# EAGLE design design-1v3 (EAGLE 9.5.1)
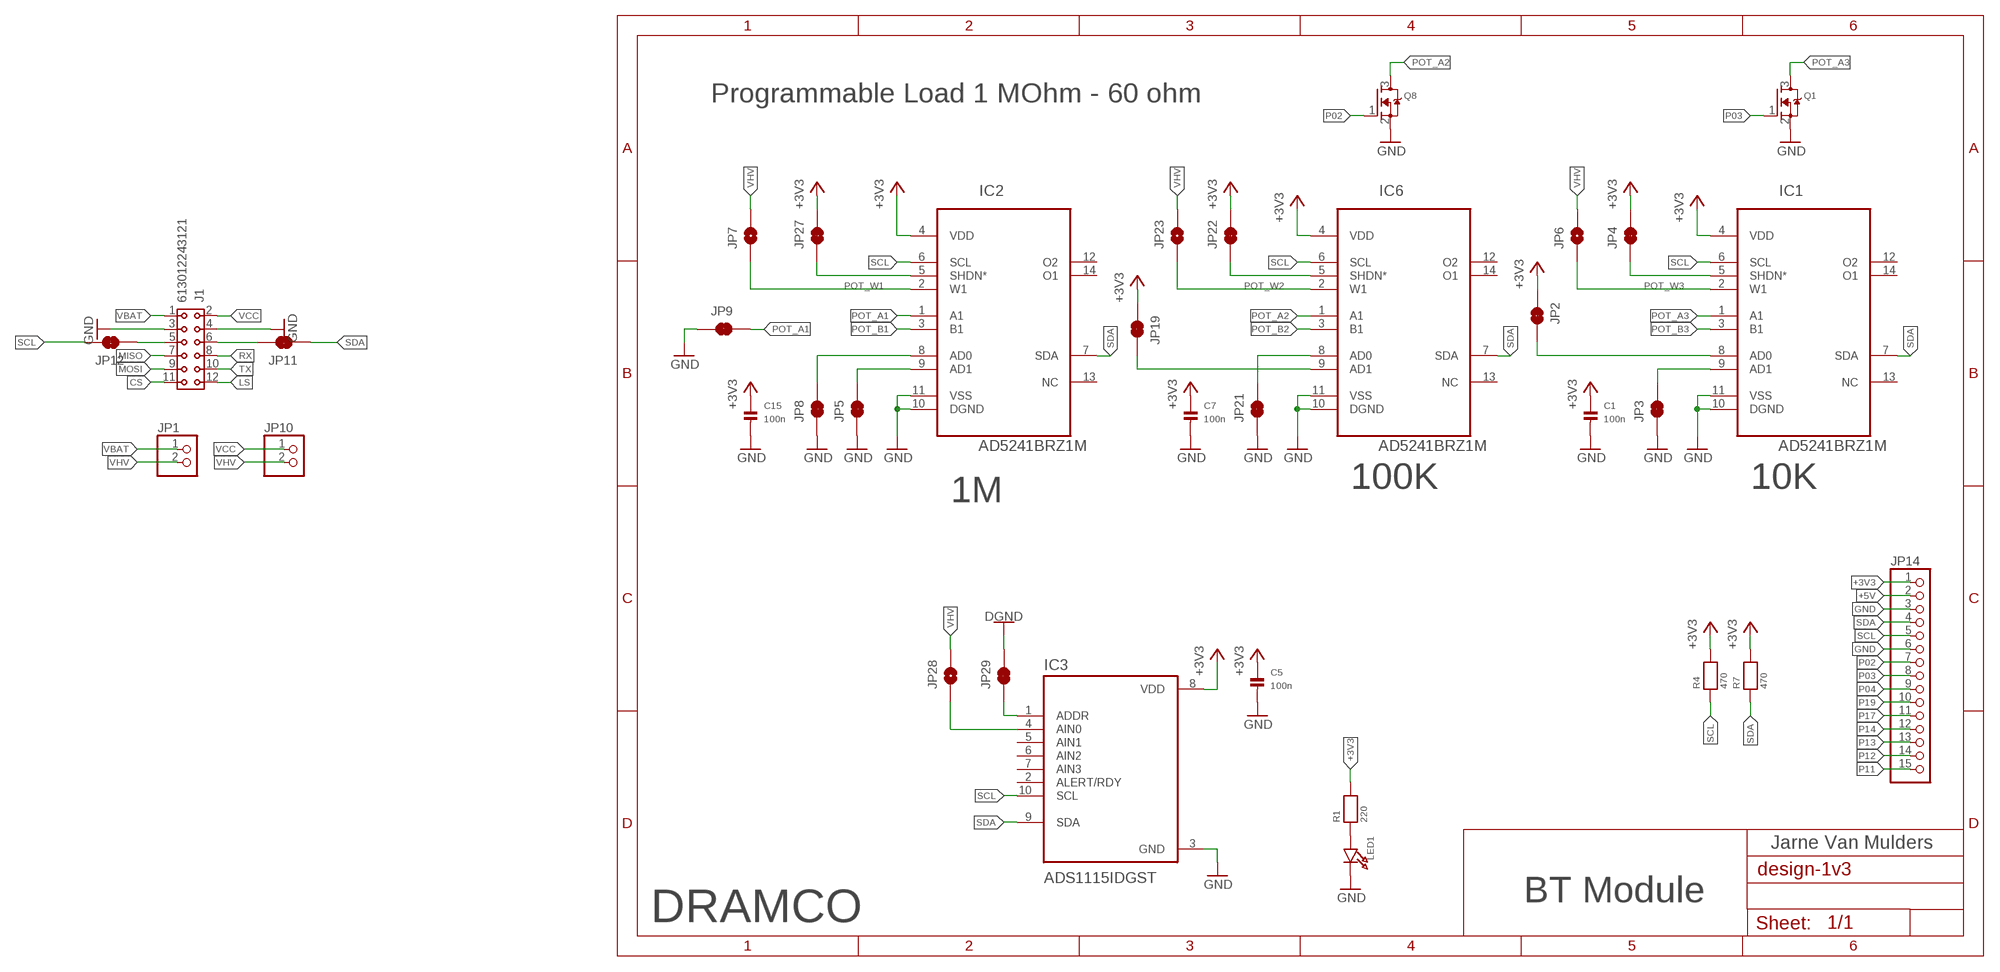
[diagram p0: schematic, sheet 1]

## Parts
C1  100n  CAP_CERAMIC0603  [0603]
C5  100n  CAP_CERAMIC0603  [0603]
C7  100n  CAP_CERAMIC0603  [0603]
C15  100n  CAP_CERAMIC0603  [0603]
IC1  AD5241BRZ1M  [SOIC127P600X175-14N]
IC2  AD5241BRZ1M  [SOIC127P600X175-14N]
IC3  ADS1115IDGST  [SOP50P490X110-10N]
IC6  AD5241BRZ1M  [SOIC127P600X175-14N]
J1  613012243121  6130XX243121_613012243121  [613012243121]
JP1  HEADER-1X2ROUND  [1X02_ROUND]
JP2  JUMPER-SMT_2_NC_TRACE_NO-SILK  [SMT-JUMPER_2_NC_TRACE_NO-SILK]
JP3  JUMPER-SMT_2_NC_TRACE_NO-SILK  [SMT-JUMPER_2_NC_TRACE_NO-SILK]
JP4  JUMPER-SMT_2_NC_TRACE_NO-SILK  [SMT-JUMPER_2_NC_TRACE_NO-SILK]
JP5  JUMPER-SMT_2_NC_TRACE_NO-SILK  [SMT-JUMPER_2_NC_TRACE_NO-SILK]
JP6  JUMPER-SMT_2_NO_NO-SILK  [SMT-JUMPER_2_NO_NO-SILK]
JP7  JUMPER-SMT_2_NO_NO-SILK  [SMT-JUMPER_2_NO_NO-SILK]
JP8  JUMPER-SMT_2_NC_TRACE_NO-SILK  [SMT-JUMPER_2_NC_TRACE_NO-SILK]
JP9  JUMPER-SMT_2_NC_TRACE_NO-SILK  [SMT-JUMPER_2_NC_TRACE_NO-SILK]
JP10  HEADER-1X2ROUND  [1X02_ROUND]
JP11  JUMPER-SMT_2_NC_TRACE_NO-SILK  [SMT-JUMPER_2_NC_TRACE_NO-SILK]
JP12  JUMPER-SMT_2_NC_TRACE_NO-SILK  [SMT-JUMPER_2_NC_TRACE_NO-SILK]
JP14  HEADER-1X15  [1X15_ROUND_70]
JP19  JUMPER-SMT_2_NC_TRACE_NO-SILK  [SMT-JUMPER_2_NC_TRACE_NO-SILK]
JP21  JUMPER-SMT_2_NC_TRACE_NO-SILK  [SMT-JUMPER_2_NC_TRACE_NO-SILK]
JP22  JUMPER-SMT_2_NC_TRACE_NO-SILK  [SMT-JUMPER_2_NC_TRACE_NO-SILK]
JP23  JUMPER-SMT_2_NO_NO-SILK  [SMT-JUMPER_2_NO_NO-SILK]
JP27  JUMPER-SMT_2_NC_TRACE_NO-SILK  [SMT-JUMPER_2_NC_TRACE_NO-SILK]
JP28  JUMPER-SMT_2_NO_NO-SILK  [SMT-JUMPER_2_NO_NO-SILK]
JP29  JUMPER-SMT_2_NC_TRACE_NO-SILK  [SMT-JUMPER_2_NC_TRACE_NO-SILK]
LED1  LED0805  [CHIPLED_0805]
Q1  MOSFET-NREFLOW  [SOT23-R]
Q8  MOSFET-NREFLOW  [SOT23-R]
R1  220  RESISTOR0603  [0603]
R4  470  RESISTOR0603  [0603]
R7  470  RESISTOR0603  [0603]

## Nets
+3V3: C1.1 C5.1 C7.1 C15.1 IC1.4(VDD) IC2.4(VDD) IC3.8(VDD) IC6.4(VDD) JP2.1 JP4.2 JP14.1 JP19.1 JP22.2 JP27.2 R1.2 R4.2 R7.2
+5V: JP14.2
CS: J1.11
GND: C1.2 C5.2 C7.2 C15.2 IC1.10(DGND) IC1.11(VSS) IC2.10(DGND) IC2.11(VSS) IC3.3(GND) IC6.10(DGND) IC6.11(VSS) J1.3 J1.4 JP3.1 JP5.1 JP8.1 JP9.1 JP14.3 JP14.6 JP21.1 JP29.2 LED1.C Q1.2(S) Q8.2(S) ; supply symbol labelled DGND
LS: J1.12
MISO: J1.7
MOSI: J1.9
N$2: IC1.8(AD0) JP2.2
N$3: IC1.9(AD1) JP3.2
N$4: IC1.5(SHDN*) JP4.1
N$5: J1.5 JP12.1
N$6: J1.6 JP11.2
N$7: IC6.9(AD1) JP19.2
N$11: IC6.8(AD0) JP21.2
N$13: IC2.5(SHDN*) JP27.1
N$15: IC2.8(AD0) JP8.2
N$16: IC2.9(AD1) JP5.2
N$20: LED1.A R1.1
N$21: IC3.4(AIN0) JP28.1
N$22: IC3.1(ADDR) JP29.1
N$23: IC6.5(SHDN*) JP22.1
P02: JP14.7 Q8.1(G)
P03: JP14.8 Q1.1(G)
P04: JP14.9
P11: JP14.15
P12: JP14.14
P13: JP14.13
P14: JP14.12
P17: JP14.11
P19: JP14.10
POT_A1: IC2.1(A1) JP9.2
POT_A2: IC6.1(A1) Q8.3(D)
POT_A3: IC1.1(A1) Q1.3(D)
POT_B1: IC2.3(B1)
POT_B2: IC6.3(B1)
POT_B3: IC1.3(B1)
POT_W1: IC2.2(W1) JP7.1
POT_W2: IC6.2(W1) JP23.1
POT_W3: IC1.2(W1) JP6.1
RX: J1.8
SCL: IC1.6(SCL) IC2.6(SCL) IC3.10(SCL) IC6.6(SCL) JP12.2 JP14.5 R4.1
SDA: IC1.7(SDA) IC2.7(SDA) IC3.9(SDA) IC6.7(SDA) JP11.1 JP14.4 R7.1
TX: J1.10
VBAT: J1.1 JP1.1
VCC: J1.2 JP10.1
VHV: JP1.2 JP6.2 JP7.2 JP10.2 JP23.2 JP28.2
Unconnected: IC1.12(O2) IC1.13(NC) IC1.14(O1) IC2.12(O2) IC2.13(NC) IC2.14(O1) IC3.2(ALERT/RDY) IC3.5(AIN1) IC3.6(AIN2) IC3.7(AIN3) IC6.12(O2) IC6.13(NC) IC6.14(O1)

## Notes on the sheet
- Programmable Load 1 MOhm - 60 ohm
- 100K | 10K
- 1M
- Jarne Van Mulders
- BT Module
- DRAMCO

## Library data of the parts
C1 C5 C7 C15 = microbuilder:CAP_CERAMIC: Ceramic Capacitors 0402 - 0402 Surface Mount Capacitors 16pF 50V 5% [Digikey: 445-4899-2-ND] 18pF 50V 5% [Digikey: 490-1281-2-ND] 22pF 50V 5% [Digikey: 490-1283-2-ND] 68pF 50V 5% [Digikey: 490-1289-2-ND] 0.1uF 10V 10% [Digikey: 490-1318-2-ND] 1.0uF 6.3V 10% [Digikey: 490-1320-2-ND] 0603 - 0603 Surface Mount Capacitors 16 pF 50V 5% [Digikey: 445-5051-2-ND] 22 pF 50V [Digikey: PCC220ACVTR-ND] 33 pF 50V 5% [Digikey: 490-1415-1-ND] 56pF 50V 5% [Digikey: 490-1421-1-ND] 220pF 50V 5% [Digikey: 445-1285-1-ND] 680 pF 50V 2200 pF 50V 5% C0G [Digikey: 445-1297-1-ND] 5600 pF 100V 5% X7R [Digikey: 478-3711-1-ND] 0.1 µF 25V 10% [Digikey: PCC2277TR-ND] 0.22 µF 16V 10% X7R [Digikey: 445-1318-1-ND] 1.0 µF 25V 10% [Digikey: 445-5146-2-ND] 0603 - RF Specific 3pF 250V +/-0.1pF RF [Digikey: 712-1347-1-ND] 18 pF 250V 5% [Digikey: 478-3505-1-ND or 712-1322-1-ND] 56 pF 250V 5% C0G RF [Digikey: 490-4867-1-ND] 68 pF 250V RF [Digikey: 490-4868-1-ND] 0805 - 0805 Surface Mount Capacitors 220 pF 250V 2% RF Ceramic Capacitor [Digikey: 712-1398-1-ND] 1000 pF 50V 2% NP0 Ceramic Capacitor [Digikey: 478-3760-1-ND] 0.1 µF 25V 10% Ceramic Capacitor [Digikey: PCC1828TR-ND] 1.0 µF 16V 10% Ceramic Capacitor[Digikey: 490-1691-2-ND] 10.0 µF 10V 10% Ceramic Capacitor[Digikey: 709-1228-1-ND] 10.0 uF 16V 10% Ceramic Capacitor [Digikey: 478-5165-2-ND] 47 uF 6.3V 20% Ceramic Capacitor [Digikey: 587-1779-1-ND or 399-5506-1-ND] 1206 - 1206 Surface Mount Capacitors 47uF 10V 20% Ceramic Capacitor [Digikey: 490-5528-1-ND or 399-5508-1-ND or 445-6010-1-ND] 100uF 6.3V -20%, +80% Y5V Ceramic Capacitor (Digikey: 490-4512-1-ND, Mouser: 81-GRM31CF50J107ZE1L)
IC1 IC2 IC6 = AD5241BRZ1M:AD5241BRZ1M: I2C Compatible Digital Potentiometer Check availability <https://pricing.snapeda.com/parts/AD5241BRZ1M/Analog%20Devices/view-part?ref=eda>; AVAILABILITY: In Stock; CHECK_PRICES: https://www.snapeda.com/parts/AD5241BRZ1M/Analog+Devices/view-part/?ref=eda; DESCRIPTION: I2C Compatible Digital Potentiometer; MF: Analog Devices; MP: AD5241BRZ1M; PACKAGE: SOIC-14 Analog Devices; PRICE: None; SNAPEDA_LINK: https://www.snapeda.com/parts/AD5241BRZ1M/Analog+Devices/view-part/?ref=snap
IC3 = ADS1115IDGST:ADS1115IDGST: Check prices <https://pricing.snapeda.com/parts/ADS1115IDGST/Texas%20Instruments/view-part?ref=eda>; AVAILABILITY: Good; DESCRIPTION: 16-Bit 860SPS 4-Ch Delta-Sigma ADC With PGA, Oscillator, Vref, Comparator, and I2C 10-VSSOP -40 to 125; MF: Texas Instruments; MP: ADS1115IDGST; PACKAGE: VSSOP-10 Texas Instruments; PRICE: None; PURCHASE-URL: https://pricing.snapeda.com/search/part/ADS1115IDGST/?ref=eda
J1 = Eagle_WR-PHD (rev25a):6130XX243121_613012243121: WR-PHD 2.54 mm Angled Dual Socket Header Article Properties Pins 4; 6; 8; 10; 12; 14; 16; 20; 22; 24; 26; 32; 34; 40; 64; 72 Material Properties Insulator Material PBT Insulator Flammability Rating UL94 V-0 Contact Material Copper Alloy Contact Plating Gold Contact Type Stamped General Information Operating Temperature -40 °C up to +105 °C Compliance Lead free / RoHS Pitch 2.54 mm Durability 25 Mating cycles Rows Dual Gender Socket Header Type Angled Electrical Properties Withstanding Voltage 500 V (AC) Contact Resistance 20 mΩ RISO 1000 MΩ CERTIFICATION UL Approval E323964 Packaging Properties Packaging Tray <https://www.we-online.com/components/media/o33216v209%20Family_WR-PHD_6130xx243121.jpg> Details see: www.we-online.com/en/components/products/PHD_2_54_ANGLED_DUAL_SOCKET_HEADER_6130XX243121 <www.we-online.com/catalog/PHD_2_54_ANGLED_DUAL_SOCKET_HEADER_6130XX243121/?utm_source=eagle_model&utm_medium=description_link&utm_campaign=eisos_eagle> Updated by Ella 2024-03-13 2024 (C) Würth Elektronik; DATASHEET-URL: https://www.we-online.com/redexpert/spec/613012243121?ae; GENDER: Socket Header; IR: 3A; MOUNT: THT; PACKAGING: Tray; PART-NUMBER: 613012243121; PINS: 12; PITCH: 2.54 mm; ROWS: Dual; TYPE: Angled
JP1 JP10 = microbuilder:HEADER-1X2: PIN HEADER
JP2-JP5 JP8 JP9 JP11 JP12 JP19 JP21 JP22 JP27 JP29 = SparkFun-Jumpers:JUMPER-SMT_2_NC_TRACE: Normally closed trace jumper This jumper has a trace between two pads so it's normally closed (NC). Use a razor knife to open the connection. For best results follow the IPC guidelines for cutting traces: Cutout at least 0.063 mm (0.005 in). Remove all loose material to clean up the cut area. Seal the cut with an approved epoxy. Reapply solder to reclose the connection.
JP6 JP7 JP23 JP28 = SparkFun-Jumpers:JUMPER-SMT_2_NO: Normally open jumper This jumper has two pads in close proximity to each other. Apply solder to close the connection. Round pads are easier to solder for beginners, but are a lot larger. SparkFun Product that uses the round pads: SparkFun EL Sequencer <https://www.sparkfun.com/products/12781>
JP14 = microbuilder:HEADER-1X15: 1x15 Header
LED1 = microbuilder:LED: LED 0603 - 0603 Surface Mount Package 2mA: Green LED - Low Power (3.9mcd, 2ma, 1.7Vf) - Digikey: 475-2709-2-ND Orange LED - Low Power (9.8mcd, 2ma, 1.8Vf) - Digikey: 475-1194-2-ND Red LED - Low Power (5mcd, 2ma, 1.8Vf) - Digikey: 475-1195-2-ND Yellow LED - Low Power (7mcd, 2ma, 1.8Vf) - Digikey: 475-1196-2-ND 5mA: Blue LED - Low Power (17mcd, 5ma, 2.9Vf) - Digikey: LNJ937W8CRACT-ND 0805 - 0805 Surface Mount Package 2mA: Red LED (8.8mcd, 2mA, 1.8Vf, Clear) - Low Power [Digikey: 475-2510-1-ND] Green LED (5mcd, 2mA, 1.8Vf, Clear) - Low Power [Digikey: 475-2730-1-ND] Yellow LED (11.3mcd, 2mA, 1.8Vf, Clear) - Low Power [Digikey: 475-2555-1-ND] 20mA: Red LED (104mcd, 20mA, Diffused) - LS R976 [Digikey: 475-1278-6-ND] Red LED (12mcd, 20mA, 2.0Vf, Clear) - APT2012EC [Digikey: 754-1128-1-ND] Green LED (15mcd, 20mA, 2.2Vf, Clear) - APT2012GC [Digikey: 754-1131-1-ND] Orange LED (160mcd, 20mA, 2.1Vf, Clear) - APT2012SECK [Digikey: 754-1130-1-ND] 1206 - 1206 Surface Mount Package Green LED (26mcd, 20mA, Diffused) - LG N971 [Digikey: 475-1407-6-ND] Red LED (15mcd, 20mA, Diffused) - LH N974 [Digikey: 475-1416-6-ND]
Q1 Q8 = microbuilder:MOSFET-N: N-Channel Mosfet LEGEND VDS: Voltage Drain-Source ID: Drain Current RDS(ON): Drain-Source On-State Resistance VGS(TH): Gate-Source Threshold Voltage CISS: Drain-Source Input Capacitance SOT-23 Name VDS ID RDS(ON) VGS(TH) CISS Order Number 2N7002E 60V 260mA 2.5 Ohm 2.5V @ 250uA 26.7pF @ 25V 2N7002ET1GOSTR-ND BSH103 30V 850mA 400 mOhm 400mV @ 1mA 83pF @ 24V BSH103,235-ND BSS138 60V 320mA 1.6 Ohm 1.5V @ 250uA 50pF @ 10V Mouser: 771-BSS138PW115 DMN2075U-7 20V 4.2A 38 mOhm 1V @ 250 uA 594.3pF @ 10V DMN2075U-7DICT-ND * BSS138 good choice for I2C level-shifting
R1 R4 R7 = microbuilder:RESISTOR: Resistors 0402 - 0402 Surface Mount Package 22 Ohm 1% 1/16W [Digikey: 311-22.0LRTR-ND] 33 Ohm 5% 1/16W 1.0K 5% 1/16W 1.5K 5% 1/16W 2.0K 1% 1/16W 10.0K 1% 1/16W [Digikey: 311-10.0KLRTR-ND] 10.0K 5% 1/16W [Digikey: RMCF0402JT10K0TR-ND] 12.1K 1% 1/16W [Digikey: 311-22.0LRTR-ND] 100.0K 5% 1/16W 0603 - 0603 Surface Mount Package 0 Ohm 1/10 Watt 1% Resistor 15 Ohm 1/10 Watt 1% Resistor 33 Ohm 1/10 Watt 1% Resistor 49.9 Ohm 1/10 Watt 1% Resistor 100 Ohm 1/10 Watt 1% Resistor 150 Ohm 1/10 Watt 1% Resistor 240 Ohm 1/10 Watt 1% Resistor 390 Ohm 1/10 Watt 1% Resistor 560 Ohm 1/10 Watt 1% Resistor 680 Ohm 1/10 Watt 1% Resistor 750 Ohm 1/10 Watt 1% Resistor 1.0K Ohm 1/10 Watt 1% Resistor 1.5K Ohm 1/10 Watt 1% Resistor 2.0K Ohm 1/10 Watt 1% Resistor 2.2K Ohm 1/10 Watt 1% Resistor 3.3K Ohm 1/10 Watt 1% Resistor 4.7K Ohm 1/10 Watt 1% Resistor 10.0K Ohm 1/10 Watt 1% Resistor 12.0K Ohm 1/10 Watt 1% Resistor 12.1K Ohm 1/10 Watt 1% Resistor 20.0K Ohm 1/10 Watt 1% Resistor 33.0K Ohm 1/10 Watt 1% Resistor 100.0K Ohm 1/10 Watt 1% Resistor 0805 - 0805 Surface Mount Package 0 Ohm 1/8 Watt 1% Resistor 33 Ohm 1/8 Watt 1% Resistor 100 Ohm 1/8 Watt 1% Resistor 150 Ohm 1/8 Watt 1% Resistor 200 Ohm 1/8 Watt 1% Resistor 240 Ohm 1/8 Watt 1% Resistor 330 Ohm 1/8 Watt 1% Resistor 390 Ohm 1/8 Watt 1% Resistor 470 Ohm 1/8 Watt 1% Resistor 1.0K Ohm 1/8 Watt 1% Resistor 1.5K Ohm 1/8 Watt 1% Resistor 2.0K Ohm 1/8 Watt 1% Resistor 4.7K Ohm 1/8 Watt 1% Resistor 5.1K Ohm 1/8 Watt 1% Resistor 5.6K Ohm 1/8 Watt 1% Resistor 10.0K Ohm 1/8 Watt 1% Resistor 22.0K Ohm 1/8 Watt 1% Resistor 33.0K Ohm 1/8 Watt 1% Resistor 100K Ohm 1/8 Watt 1% Resistor 1206 - 1206 Surface Mount Package 2012 - 2010 Surface Mount Package 0.11 Ohm 1/2 Watt 1% Resistor - Digikey: RHM.11UCT-ND

## Board
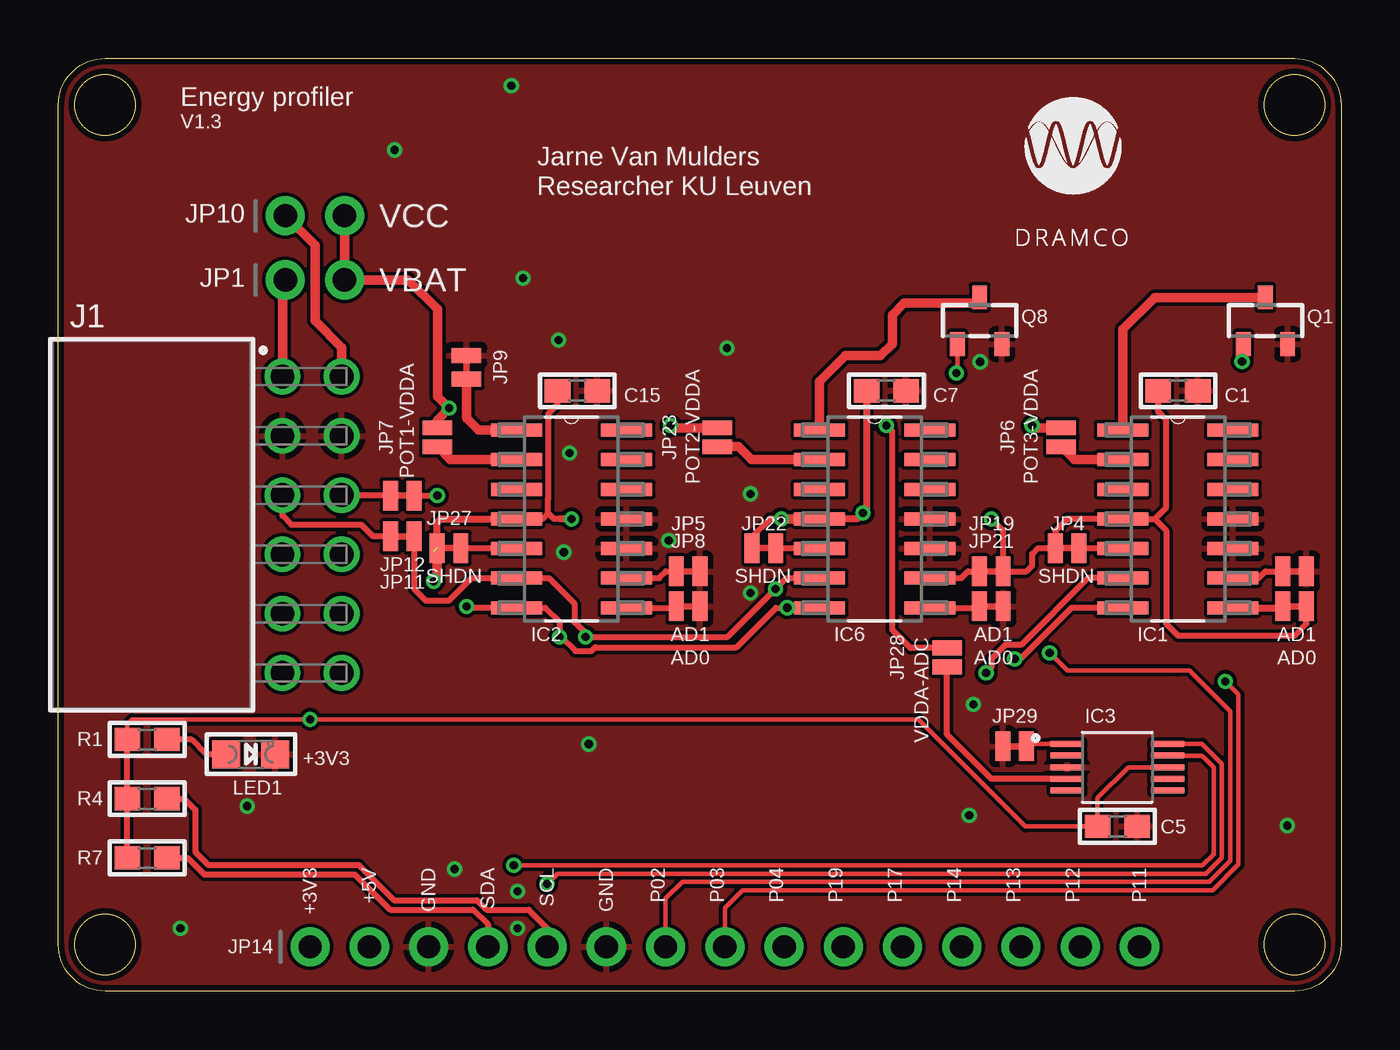
[diagram p1: board, top side]
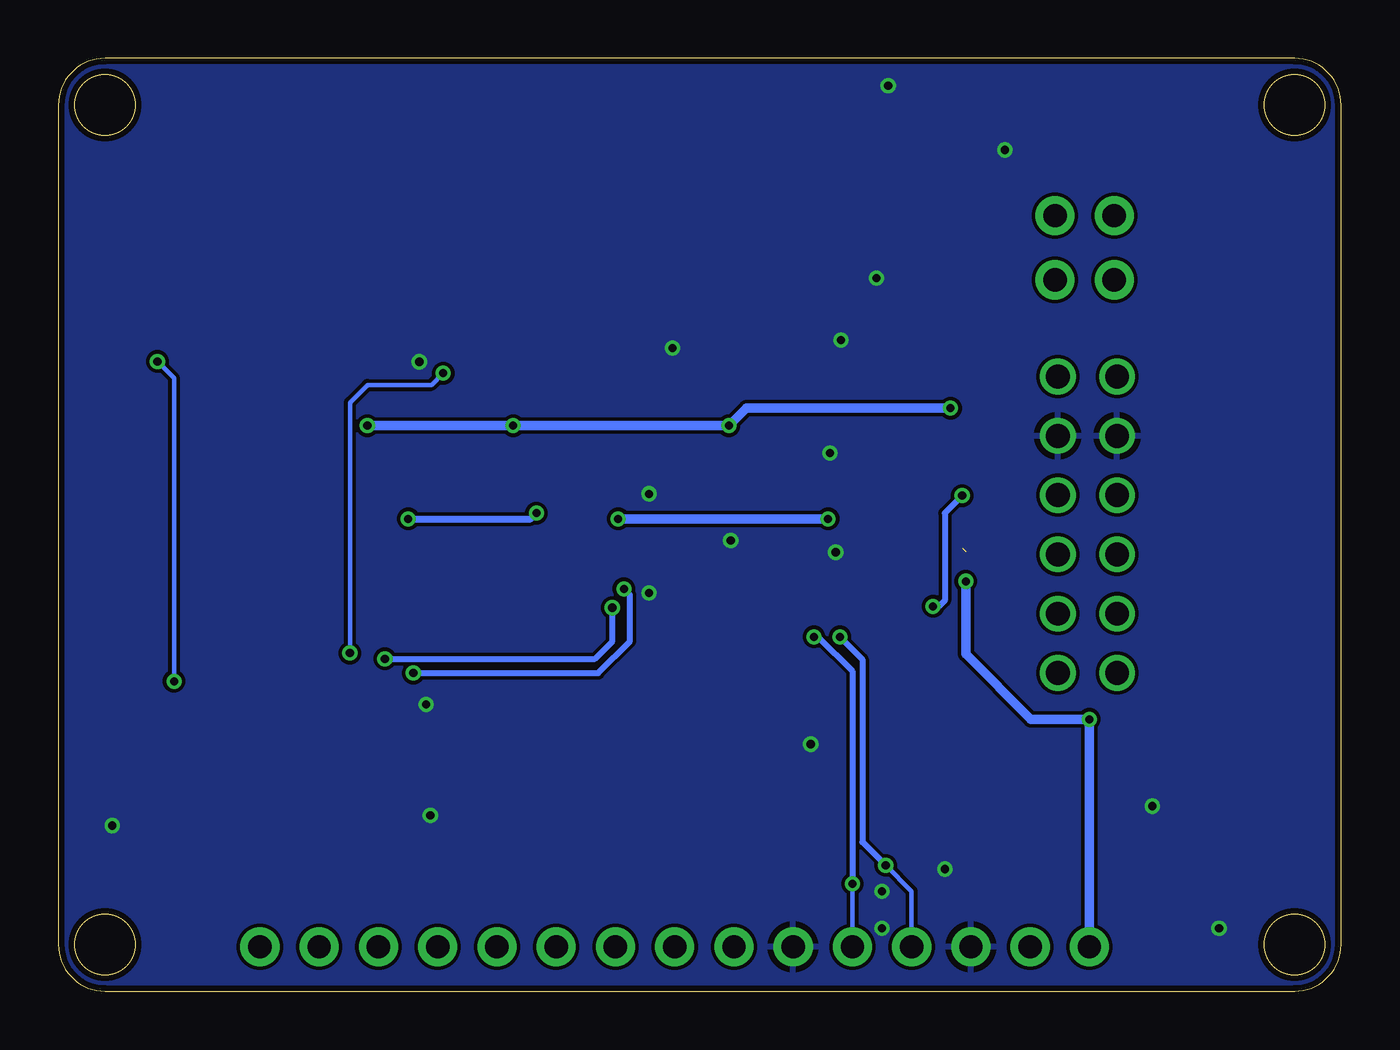
[diagram p2: board, bottom side, seen from below]

Size 55 x 40 mm. Coordinates in mm from the lower left corner, seen from the top.
Outline: 0,2 0,38 arc-90 2,40 53,40 arc-90 55,38 55,2 arc-90 53,0 2,0 arc-90 0,2
Outline: circle at 2,38 radius 1.3
Outline: circle at 2,2 radius 1.3
Outline: circle at 53,38 radius 1.3
Outline: circle at 53,2 radius 1.3
Copper layers (1*16): Top 0.035mm / dielectric 1.5mm / Bottom 0.035mm
Design rules "SeeedStudio_2layer_DRU_no_angle_20140221-2": minimum track width 6mil, minimum drill 12mil, track to track 6mil, track to pad 6mil, pad to pad 6mil, via to via 6mil, smd to smd 0mil, copper to edge 10mil, drill to drill 10mil, minimum pad ring 10mil, minimum via ring 6mil, stop-mask expansion 2mil, vias tented up to drill 100mil, thermal gap 10mil

### Footprints (pad centres in the part's own frame; a part is rotated, then mirrored left to right if it is on the bottom)
0603 = smd 1.1 x 1: 1 -0.85,0; 2 0.85,0
SOIC127P600X175-14N = smd 2.184 x 0.559: 1 -2.362,3.81; 2 -2.362,2.54; 3 -2.362,1.27; 4 -2.362,0; 5 -2.362,-1.27; 6 -2.362,-2.54; 7 -2.362,-3.81; 8 2.362,-3.81; 9 2.362,-2.54; 10 2.362,-1.27; 11 2.362,0; 12 2.362,1.27; 13 2.362,2.54; 14 2.362,3.81
SOP50P490X110-10N = smd 1.47 x 0.28: 1 -2.15,1; 2 -2.15,0.5; 3 -2.15,0; 4 -2.15,-0.5; 5 -2.15,-1; 6 2.15,-1; 7 2.15,-0.5; 8 2.15,0; 9 2.15,0.5; 10 2.15,1
613012243121 = drill 1.02: 1 -6.35,5.61; 2 -6.35,8.15; 3 -3.81,5.61; 4 -3.81,8.15; 5 -1.27,5.61; 6 -1.27,8.15; 7 1.27,5.61; 8 1.27,8.15; 9 3.81,5.61; 10 3.81,8.15; 11 6.35,5.61; 12 6.35,8.15
1X02_ROUND = drill 1 pad 1.676: 1 -1.27,0; 2 1.27,0
SMT-JUMPER_2_NC_TRACE_NO-SILK = smd 0.635 x 1.27: 1 -0.508,0; 2 0.508,0
SMT-JUMPER_2_NO_NO-SILK = smd 0.635 x 1.27: 1 -0.406,0; 2 0.406,0
1X15_ROUND_70 = drill 1 pad 1.676: 1 -17.78,0; 2 -15.24,0; 3 -12.7,0; 4 -10.16,0; 5 -7.62,0; 6 -5.08,0; 7 -2.54,0; 8 0,0; 9 2.54,0; 10 5.08,0; 11 7.62,0; 12 10.16,0; 13 12.7,0; 14 15.24,0; 15 17.78,0
CHIPLED_0805 = smd 1.2 x 1.2: A 0,-1.05; C 0,1.05
SOT23-R = smd 0.635 x 1.016: 1 -0.95,-1; 2 0.95,-1; 3 0,1

### Placement (x,y rotation side)
C1  48,25.75 0 top
C5  45.4,7.07 0 top
C7  35.5,25.75 0 top
C15  22.25,25.75 0 top
IC1  48,20.25 0 top
IC2  22,20.25 0 top
IC3  45.4,9.61 0 top
IC6  35,20.25 0 top
J1  4,20 270 top
JP1  11,30.5 0 top
JP2  53,16.5 180 top
JP3  53,18 180 top
JP4  43.25,19 180 top
JP5  27,18 180 top
JP6  43,23.75 90 top
JP7  16.25,23.75 90 top
JP8  27,16.5 180 top
JP9  17.5,26.75 270 top
JP10  11,33.25 0 top
JP11  14.75,21.25 180 top
JP12  14.75,19.5 0 top
JP14  28.57,1.91 0 top
JP19  40,18 180 top
JP21  40,16.5 180 top
JP22  30.25,19 180 top
JP23  28.25,23.75 90 top
JP27  16.75,19 180 top
JP28  38.1,14.31 90 top
JP29  41,10.5 180 top
LED1  8.26,10.16 270 top
Q1  51.75,28.75 0 top
Q8  39.5,28.75 0 top
R1  3.81,10.79 180 top
R4  3.81,8.26 180 top
R7  3.81,5.71 180 top

### Tracks (layer width: path | path; a pad name or v marks a point on that pad's centre or on a via)
+3V3  (via drill 0.35)  (1 unrouted)
  Top 0.2: 41.47,7.07 36.88,11.66
  Top 0.203: R1.2 2.96,11.44 3.17,11.66 v10.79,11.66 36.88,11.66 | IC3.8 45.88,9.61 44.55,8.28 C5.1 41.47,7.07
  Top 0.254: R7.2 R4.2 R1.2 | 16.09,18.84 16.09,18.76 | v31,20.25 30.5,20.25 29.74,19.49 JP22.2 | v40,20.25 40.51,19.74 JP19.1 41.5,18 41.75,18.25 41.75,18.75 42,19 JP4.2 42.74,19.74 43.25,20.25 IC1.4 47,20.25 | 47,20.25 47.5,20.75 47.5,24.5 47.15,24.85 C1.1 | 47,20.25 47.5,19.75 47.5,15.75 48,15.25 53,15.25 53.51,15.76 JP2.1 | IC2.4 20.75,20.25 21,20.5 | 21.5,20.25 21.25,20.25 21,20.5 | 21,20.5 21,21.11 21.01,21.12 21.01,24.76 21.4,25.15 C15.1
  Top 0.305: v22,20.25 21.5,20.25 | IC2.4 16.39,20.25 16.24,20.11 JP27.2 | IC6.4 34.25,20.25 v34.5,20.5 34.65,20.65 C7.1
  Top 0.406: v31,20.25 IC6.4 | JP27.2 16.24,17.72 v16.09,17.57
  Bottom 0.305: v40,20.25 34.75,20.25 v34.5,20.5
  Bottom 0.406: JP14.1 v10.79,11.66 13.29,11.66 16.09,14.45 v16.09,17.57 | v22,20.25 v31,20.25
GND  (via drill 0.35)
  other vias: 5.24,2.7 19.68,2.7 8.1,7.94 22.75,10.59 19.42,38.82 39.05,7.54 39.23,12.3 52.69,7.1 21.45,27.92 16.99,5.24 19.68,4.29 19.92,30.57 14.42,36.07 29.67,17.07 26.17,19.32 29.67,21.32 21.67,18.82 21.92,23.07 39.52,26.99 28.67,27.57
  pour Top (rank 6): -5.51,44.61 60.64,44.61 60.64,-4.81 -5.51,-4.81
  pour Bottom (rank 6): 61.98,45.79 -3.18,45.79 -3.18,-2.64 61.98,-2.64
N$2
  Top 0.305: IC1.8 52.43,16.44 JP2.2
N$3
  Top 0.254: IC1.9 51.46,17.71 51.75,18 JP3.2
N$4
  Top 0.254: IC1.5 43.78,18.98 JP4.1
N$5
  Top 0.254: JP12.1 13.5,19.5 13,20 10,20 9.61,20.39 J1.5
N$6
  Top 0.254: JP11.2 12.17,21.25 J1.6
N$7
  Top 0.254: IC6.9 38.71,17.71 39,18 JP19.2
N$11
  Top 0.254: IC6.8 39.43,16.44 JP21.2
N$13
  Top 0.254: IC2.5 17.28,18.98 JP27.1
N$15
  Top 0.254: IC2.8 26.43,16.44 JP8.2
N$16
  Top 0.254: IC2.9 25.75,17.71 26.04,18 JP5.2
N$20
  Top 0.254: R1.1 5.71,10.79 6.35,10.16 LED1.A
N$21
  Top 0.254: IC3.4 40,9.11 38.1,11.01 JP28.1
N$22
  Top 0.203: JP29.1 41.61,10.61 IC3.1
N$23
  Top 0.254: JP22.1 33.12,19 IC6.5
P02  (via drill 0.35)
  Top 0.2: JP14.7 26.04,3.97 26.75,4.69 49.35,4.69 50.24,5.58 50.24,11.99 | v42.5,14.5 43.25,13.75 48,13.75 | Q8.1 38.55,26.55 v38.5,26.5
  Top 0.203: 50.24,11.99 48.48,13.75 48,13.75
  Bottom 0.2: v42.5,14.5 42.5,25.25 41.75,26 39,26 v38.5,26.5
P03  (via drill 0.35)
  Top 0.2: JP14.8 28.57,3.58 29.34,4.33 49.49,4.33 50.59,5.44 50.59,11.84 | Q1.1 50.8,27.05 v50.75,27
  Top 0.203: v50.03,13.29 50.59,12.72 50.59,11.84
  Bottom 0.2: v50.03,13.29 50.03,26.29 v50.75,27
POT_A1
  Top 0.406: IC2.1 18.02,24.06 17.5,24.58 JP9.2
POT_A2
  Top 0.406: Q8.3 39.25,29.5 36.25,29.5 35.75,29 35.75,27.75 35.25,27.25 33.75,27.25 32.64,26.14 IC6.1
POT_A3
  Top 0.406: Q1.3 47,29.75 45.64,28.39 IC1.1
POT_W1
  Top 0.406: IC2.2 16.8,22.79 JP7.1
POT_W2
  Top 0.406: IC6.2 29.71,22.79 29.16,23.34 JP23.1
POT_W3
  Top 0.406: IC1.2 43.55,22.79 JP6.1
SCL  (via drill 0.35)
  Top 0.203: IC3.10 49.03,10.61 49.89,9.75 49.89,5.73 49.2,5.04 21.39,5.04 v20.95,4.6
  Top 0.254: R4.1 5.4,8.26 5.87,7.78 5.87,5.97 6.43,5.42 12.88,5.42 14.4,3.9 17.95,3.9 18.36,3.49 20.16,3.49 20.95,2.7 JP14.5 | IC6.6 31.21,17.71 v30.75,17.25 28.69,15.19 v22.6,15.19 22.6,15.35 22.12,15.83 22.12,16.62 21.04,17.71 IC2.6 17.71,17.71 16.75,16.75 15.75,16.75 15.26,17.24 JP12.2 | IC1.6 44.13,17.71 41.28,14.86 40.61,14.86 40,14.25 40,13.86 v39.78,13.64
  Bottom 0.203: v20.95,4.6 JP14.5
  Bottom 0.254: v22.6,15.19 22.41,15.19 22.41,15.18 20.95,13.72 v20.95,4.6 | v39.78,13.64 31.86,13.64 30.5,15 30.5,17 v30.75,17.25
SDA  (via drill 0.35)
  Top 0.203: IC3.9 47.58,10.08 49.05,10.08 49.53,9.61 49.53,5.87 49.05,5.4 v19.53,5.4
  Top 0.254: R7.1 5.56,5.71 6.26,5.01 12.71,5.01 14.23,3.49 17.78,3.49 18.41,2.86 JP14.4 | IC6.7 v31.25,16.44 30.77,16.44 29.07,14.75 23.02,14.75 22.85,14.59 22.16,14.59 21.56,15.19 v21.49,15.19 21.49,15.83 20.88,16.44 IC2.7 17.56,16.44 v17.5,16.5 | IC1.7 43.44,16.44 41.25,14.25 v41,14.25 | JP11.1 v16.25,21.25
  Bottom 0.203: v19.53,5.4 18.41,4.29 JP14.4
  Bottom 0.254: v21.49,15.19 20.53,14.23 20.53,6.4 v19.53,5.4 | v41,14.25 32,14.25 31.25,15 v31.25,16.44 | v16.25,21.25 17,20.5 17,16.75 17.25,16.5 v17.5,16.5
VBAT
  Top 0.406: J1.1 9.61,30.38 JP1.1
VCC
  Top 0.406: J1.2 12.15,27.6 11,28.75 11,31.98 JP10.1
VHV  (via drill 0.35)
  Top 0.254: JP28.2 36.53,14.72 35.75,15.5 35.75,24 v35.5,24.25
  Top 0.406: JP23.2 26.34,24.16 v26.25,24.25 | JP6.2 41.84,24.16 v41.75,24.25 | JP7.2 16.25,24.5 v16.75,25 16.25,25.5 16.25,29.25 15,30.5 JP1.2 JP10.2
  Bottom 0.406: v16.75,25 25.5,25 v26.25,24.25 v35.5,24.25 v41.75,24.25

### Text on the board
tPlace: Energy profiler | V1.3 | Jarne Van Mulders | Researcher KU Leuven | VCC | VBAT | POT1-VDDA | POT2-VDDA | POT3-VDDA | SHDN | SHDN | SHDN | AD1 | AD1 | AD1 | AD0 | AD0 | AD0 | VDDA-ADC | +3V3 | +3V3 | +5V | GND | SDA | SCL | GND | P02 | P03 | P04 | P19 | P17 | P14 | P13 | P12 | P11